# Altium schematic sheet Acondicionamiento_70Q.SchDoc
size A4
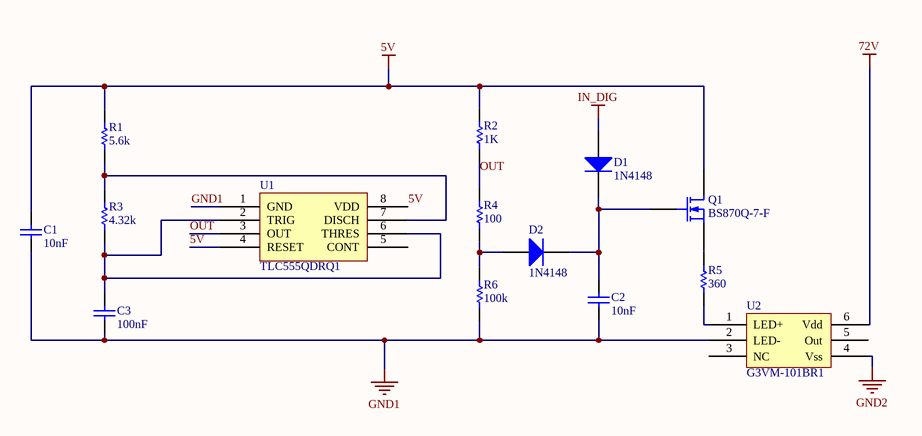
[diagram p0: Acondicionamiento_70Q.SchDoc]

## Parts
C1  10nF  [C0805]
C2  10nF  [C0805]
C3  100nF  [C0805_B]
D1  1N4148  [SOD-323-2]
D2  1N4148  [SOD-323-2]
Q1  BS870Q-7-F  [SOT23_3]
R1  5.6k  [R-0805]
R2  1K  [R-0805]
R3  4.32k  [R-0805]
R4  100  [R-0805]
R5  360  [R-0805]
R6  100k  [R-0805]
U1  TLC555QDRQ1  [SOIC8]
U2  G3VM-101BR1  [DIP-6]

## Nets
5V: C1.2 Q1.3(D) R1.2 R2.2 U1.4(RESET) U1.8(VDD)
72V: U2.6(Vdd)
GND1: C1.1 C2.1 C3.1 R6.1 U1.1(GND) U2.2(LED-)
GND2: U2.4(Vss)
IN_DIG: D1.1(A)
OUT: R2.1 R4.2 U1.3(OUT)
NetC2_2: C2.2 D1.2(K) D2.2(K) Q1.1(G)
NetC3_2: C3.2 R3.1 U1.2(TRIG) U1.6(THRES)
NetD2_1: D2.1(A) R4.1 R6.2
NetQ1_2: Q1.2(S) R5.2
NetR1_1: R1.1 R3.2 U1.7(DISCH)
NetR5_1: R5.1 U2.1(LED+)

Not connected (* = marked no-connect by the designer): U1 5(CONT); U2 3(NC) 5(Out)

## Library data of the parts
C1 C2 = CAP-10nF/50V: C0805C103K5RACTU - CAP, 0.01µF, 50V, 10%, X7R, 0805, REEL; Manufacturer: KEMET; Precio: $0.20; Supplier 1: Newark; Manufacturer Part Number: C0805C103K5RACTU; Stock 1: 2341; Pricing 1: 1=0.018, 25=0.018, 50=0.018, 100=0.018, 250=0.018, 500=0.018, 1000=0.018 (USD); Mount: Surface Mount; Case/Package: 0805; Case Code (Imperial): 0805; Case Code (Metric): 2012; Contact Plating: Tin,Matte; Min Operating Temperature: -55°C; Max Operating Temperature: 125°C; Capacitance: 10nF; Tolerance: 10%; Packaging: Tape and Reel; Voltage Rating (DC): 50V; Dielectric: X7R; Package Quantity: 4000; Voltage Rating: 50V; Termination: SMD/SMT; Voltage: 50V; Length: 2mm; Height: 0.78mm; Width: 1.2mm; Lead Pitch: 0.75mm; Depth: 1.25mm; Radiation Hardening: No; Supplier Part Number 1: 01J3314; ComponentLink1Description: https://www.mouser.mx/datasheet/2/212/KEM_C1002_X7R_SMD-1102033.pdf; ComponentLink1URL: https://www.mouser.mx/datasheet/2/212/KEM_C1002_X7R_SMD-1102033.pdf
C3 = CAP-0.1uF_0805_B: CC0805JPX7R8BB104; Manufacturer: Yageo; Manufacturer Part Number: CC1206JKX7R9BB105; Capacitance: 1uF; Tolerance: 5%; Voltage Rating: 50V; Published: 8-Jun-2000; LatestRevisionDate: 17-Jul-2002; LatestRevisionNote: Re-released for DXP Platform.; PackageReference: RAD-0.3; Publisher: Altium Limited; PackageDescription: Radial Cap, Thru-Hole; 2 Leads; 0.3 in Pin Spacing; Supplier 1: Mouser; Stock 1: 11880; Pricing 1: 1=0.48, 10=0.342, 50=0.342, 100=0.197, 500=0.166, 1000=0.124, 2000=0.117, 4000=0.11, 10000=0.102, 24000=0.092 (USD); Mount: Surface Mount; Case/Package: 1206; Case Code (Imperial): 1206; Case Code (Metric): 3216; Min Operating Temperature: -55°C; Max Operating Temperature: 125°C; Packaging: Cut Tape; ComponentLink1URL: http://www.yageo.com/documents/recent/UPY-GPHC_X7R_6.3V-to-50V_18.pdf?src-supplier=Digi-Key; ComponentLink1Description: http://www.yageo.com/documents/recent/UPY-GPHC_X7R_6.3V-to-50V_18.pdf?src-supplier=Digi-Key; Supplier Part Number 1: 603-CC1206JK7R9BB105; Supplier 2: Mouser; Stock 2: 51578; Pricing 2: 1=0.18, 10=0.091, 50=0.091, 100=0.041, 1000=0.034, 10000=0.024 (USD); Supplier Part Number 2: 603-CC0805JPX7R8BB10
D1 D2 = DIO-1N4148: 1N4148WS-HG3-08; Manufacturer: Vishay Semiconductors; Precio: $0.481; Supplier 1: Mouser; Manufacturer Part Number: 1N4148WS-HG3-08; Stock 1: 9340; Pricing 1: 1=0.37, 10=0.272, 50=0.272, 100=0.138, 500=0.105, 1000=0.064, 3000=0.055, 6000=0.054, 9000=0.045, 10000=0.045, 24000=0.037 (USD); ComponentLink1URL: http://www.vishay.com/docs/85413/1n4148wsg.pdf?src-supplier=Digi-Key; ComponentLink1Description: http://www.vishay.com/docs/85413/1n4148wsg.pdf?src-supplier=Digi-Key
Q1 = MOS_N-BS870Q-7-F: MOSFET CHANNEL N 41V 60V SOT23; Manufacturer: Diodes; Continuous Drain Current (ID): 250mA; Rds On Max: 5R; Input Capacitance: 50pF; Max Power Dissipation: 300mW; Precio: $0.38; Supplier 1: Mouser; Manufacturer Part Number: BS870Q-7-F; Stock 1: 2749; Pricing 1: 1=0.29, 10=0.197, 50=0.197, 100=0.083, 1000=0.056, 10000=0.038 (USD); Mount: Surface Mount; Case/Package: SOT-23; Min Operating Temperature: -55°C; Max Operating Temperature: 150°C; Packaging: Cut Tape; Drain to Source Voltage (Vdss): 60V; ComponentLink1URL: https://www.diodes.com/assets/Datasheets/BS870Q.pdf?src-supplier=Digi-Key; ComponentLink1Description: https://www.diodes.com/assets/Datasheets/BS870Q.pdf?src-supplier=Digi-Key; Supplier Part Number 1: 621-BS870Q-7-F
R1 = RES-5.6K/0805: PCF0805-13-5K6BT1 WELWYN  THIN FILM RESISTOR, 5.6KOHM, 100mW 0.1%; Manufacturer: TT Welwyn; Manufacturer Part Number: PCF0805-13-5K6-B-T1; Resistance: 5.6kR; Voltage Rating: 100V; Temperature Coefficient: 5ppm/°C; Precio: $0.99; Supplier 1: Mouser; Stock 1: 0; Case/Package: 0805; Number of Pins: 2; Weight: 0.000317oz; Case Code (Imperial): 0805; Case Code (Metric): 2012; Min Operating Temperature: -55°C; Max Operating Temperature: 125°C; Power Rating: 100mW; Tolerance: 0.1%; Packaging: Tape and Reel; Package Quantity: 1000; Composition: Thin Film,Metal Film; Termination: SMD/SMT; Military Standard: Not; Voltage Rating (DC): 100V; Voltage Rating (AC): 100V; Length: 2mm; Height: 0.65mm; Width: 1.25mm; Depth: 1.25mm; REACH SVHC: No SVHC; ComponentLink1URL: http://www.mouser.com/ds/2/414/PCF-437472.pdf?src-supplier=Mouser; ComponentLink1Description: http://www.mouser.com/ds/2/414/PCF-437472.pdf?src-supplier=Mouser; ComponentLink2URL: http://www.farnell.com/datasheets/1315872.pdf?src-supplier=Element14; ComponentLink2Description: http://www.farnell.com/datasheets/1315872.pdf?src-supplier=Element14; ComponentLink3URL: http://www.farnell.com/datasheets/1520194.pdf?src-supplier=Element14; ComponentLink3Description: http://www.farnell.com/datasheets/1520194.pdf?src-supplier=Element14; Supplier Part Number 1: 756-PCF0805135K6BT1
R2 = RES-1K/0805: Thin Film Resistors - SMD 1Kohms .1% 25ppm; Manufacturer: Vishay Sfernice; Manufacturer Part Number: P-0805E1001BBT1; Resistance: 1kR; Power Rating: 250mW; Tolerance: 0.1%; Voltage Rating: 100V; Temperature Coefficient: 25ppm/°C; Precio: $1.64; Supplier 1: Mouser; Stock 1: 1066; Pricing 1: 1=1.26, 10=1.04, 50=1.04, 100=0.796, 500=0.685, 1000=0.54, 2000=0.504, 5000=0.479, 10000=0.461, 25000=0.447 (USD); Case/Package: 0805; Weight: 0.000194oz; Case Code (Imperial): 0805; Case Code (Metric): 2012; Min Operating Temperature: -55°C; Max Operating Temperature: 125°C; Packaging: Tape and Reel; Package Quantity: 1000; Termination: SMD/SMT; Composition: Thin Film; Length: 0.08inch; Height: 0.015inch; Width: 0.05inch; ComponentLink1URL: http://www.mouser.com/ds/2/427/pns-65592.pdf?src-supplier=Mouser; ComponentLink1Description: http://www.mouser.com/ds/2/427/pns-65592.pdf?src-supplier=Mouser
R3 = Res-4.32k: ERA-6AEB4321V; Manufacturer: Panasonic; Resistance: 4.32kR; Tolerance: 0.1%; Temperature Coefficient: 25ppm/°C; Voltage Rating: 100V; Power Rating: 125mW; Supplier 1: Mouser; Stock 1: 7358; Pricing 1: 1=0.36, 10=0.302, 50=0.302, 100=0.118, 1000=0.045, 10000=0.034 (USD); Mount: Surface Mount; Case/Package: 0805; Number of Pins: 2; Contact Plating: Tin; Min Operating Temperature: -55°C; Max Operating Temperature: 155°C; Composition: Metal Film,Thin Film; Packaging: Tape and Reel; Package Quantity: 5000; Number of Terminations: 2; Termination: SMD/SMT; Military Standard: Not; Max Power Dissipation: 125mW; Voltage Rating (DC): 100V; Features: Automotive AEC-Q200; Length: 2mm; Height: 0.5mm; Width: 1.25mm; Depth: 1.25mm; Radiation Hardening: No; Lead Free: Lead Free; ComponentLink1URL: http://www.farnell.com/datasheets/485442.pdf?src-supplier=Farnell; ComponentLink1Description: http://www.farnell.com/datasheets/485442.pdf?src-supplier=Farnell; ComponentLink2URL: http://www.mouser.com/ds/2/315/AOA0000CE26-32660.pdf?src-supplier=Mouser; ComponentLink2Description: http://www.mouser.com/ds/2/315/AOA0000CE26-32660.pdf?src-supplier=Mouser; ComponentLink3URL: http://www.farnell.com/datasheets/485442.pdf?src-supplier=Element14; ComponentLink3Description: http://www.farnell.com/datasheets/485442.pdf?src-supplier=Element14; ComponentLink4URL: http://industrial.panasonic.com/www-data/pdf/AOA0000/AOA0000CE26.pdf?src-supplier=Avnet+Europe; ComponentLink4Description: http://industrial.panasonic.com/www-data/pdf/AOA0000/AOA0000CE26.pdf?src-supplier=Avnet+Europe; ComponentLink5URL: http://uk.rs-online.com/webdocs/0eb1/0900766b80eb1d8c.pdf?src-supplier=RSComponents; ComponentLink5Description: http://uk.rs-online.com/webdocs/0eb1/0900766b80eb1d8c.pdf?src-supplier=RSComponents; ComponentLink6URL: https://produktinfo.conrad.com/datenblaetter/450000-474999/459076-da-01-en-WIDERSTAND_0805_ERA.pdf?src-supplier=Conrad; ComponentLink6Description: https://produktinfo.conrad.com/datenblaetter/450000-474999/459076-da-01-en-WIDERSTAND_0805_ERA.pdf?src-supplier=Conrad; Manufacturer Part Number: ERA-6AEB4321V; Case Code (Imperial): 0805; Case Code (Metric): 2012; Supplier Part Number 1: 667-ERA-6AEB4321V
R4 = RES-100: MCU08050C1000FP500; Manufacturer: Vishay Beyschlag; Resistance: 100R; Tolerance: 1%; Temperature Coefficient: 50ppm/°C; Power Rating: 125mW; Voltage Rating: 150V; Max Power Dissipation: 200mW; Precio: $0.65; Supplier 1: Mouser; Manufacturer Part Number: MCU08050C1000FP500; Stock 1: 19308; Pricing 1: 1=0.5, 10=0.285, 50=0.285, 100=0.153, 500=0.123, 1000=0.091, 2500=0.079, 5000=0.072, 10000=0.064, 25000=0.06 (USD); Case/Package: 0805; Weight: 0.000162oz; Contact Plating: Tin; Case Code (Metric): 2012; Case Code (Imperial): 0805; Min Operating Temperature: -55°C; Max Operating Temperature: 125°C; Composition: Thin Film; Package Quantity: 1; Packaging: Tape and Reel; Number of Terminations: 2; Termination: SMD/SMT; Military Standard: Not; Voltage Rating (DC): 150V; Length: 2mm; Height: 0.024inch; Width: 0.049inch; Depth: 1.25mm; Radiation Hardening: No; REACH SVHC: No SVHC; Lead Free: Lead Free; ComponentLink1URL: http://www.vishay.com/docs/28705/mcx0x0xpro.pdf?src-supplier=Digi-Key; ComponentLink1Description: http://www.vishay.com/docs/28705/mcx0x0xpro.pdf?src-supplier=Digi-Key; ComponentLink2URL: http://www.vishay.com/docs/28705/mc_pro.pdf?src-supplier=Avnet; ComponentLink2Description: http://www.vishay.com/docs/28705/mc_pro.pdf?src-supplier=Avnet; ComponentLink3URL: http://www.vishay.com/docs/28705/mc_pro.pdf?src-supplier=Avnet+Europe; ComponentLink3Description: http://www.vishay.com/docs/28705/mc_pro.pdf?src-supplier=Avnet+Europe
R5 = RES-360: ERJ-6ENF3600V            RESISTOR, THICK FILM, 360OHM, 125mW, ± 1%; Manufacturer: Panasonic; Resistance: 360R; Temperature Coefficient: 100ppm/°C; Voltage Rating: 150V; Precio: $0.012; Supplier 1: Newark; Supplier Part Number 1: 52W0059; Manufacturer Part Number: ERJ-6ENF3600V; Stock 1: 0; Mount: Surface Mount; Case/Package: 0805; Contact Plating: Tin; Case Code (Metric): 2012; Case Code (Imperial): 0805; Min Operating Temperature: -55°C; Max Operating Temperature: 155°C; Tolerance: 1%; Composition: Thick Film; Power Rating: 125mW; Packaging: Tape and Reel; Package Quantity: 1; Number of Terminations: 2; Termination: SMD/SMT; Military Standard: Not; Max Power Dissipation: 125mW; Voltage Rating (DC): 150V; Features: Automotive AEC-Q200; Length: 2mm; Height: 0.6mm; Width: 0.049inch; Depth: 1.25mm; Radiation Hardening: No; REACH SVHC: No SVHC; Lead Free: Lead Free; ComponentLink1URL: http://industrial.panasonic.com/www-data/pdf/AOA0000/AOA0000CE2.pdf?src-supplier=Avnet+Europe; ComponentLink1Description: http://industrial.panasonic.com/www-data/pdf/AOA0000/AOA0000CE2.pdf?src-supplier=Avnet+Europe; ComponentLink2URL: https://www.alliedelec.com/m/d/623f45ff1957d936ff56d46fd1c28cac.pdf?src-supplier=Allied+Electronics; ComponentLink2Description: https://www.alliedelec.com/m/d/623f45ff1957d936ff56d46fd1c28cac.pdf?src-supplier=Allied+Electronics; ComponentLink3URL: http://www.mouser.com/ds/2/315/AOA0000CE2-37512.pdf?src-supplier=Mouser; ComponentLink3Description: http://www.mouser.com/ds/2/315/AOA0000CE2-37512.pdf?src-supplier=Mouser; ComponentLink4URL: http://industrial.panasonic.com/www-data/pdf/AOA0000/AOA0000CE2.pdf?src-supplier=Avnet; ComponentLink4Description: http://industrial.panasonic.com/www-data/pdf/AOA0000/AOA0000CE2.pdf?src-supplier=Avnet; ComponentLink5URL: http://www.farnell.com/datasheets/1678782.pdf?src-supplier=Element14; ComponentLink5Description: http://www.farnell.com/datasheets/1678782.pdf?src-supplier=Element14
R6 = RES-100k/0805: TNPW0805100KBEEA Res Thick Film 1206 100K Ohm 1% 0.25W(1/4W) ±100ppm/C Pad SMD T/R; Manufacturer: Vishay Dale; Resistance: 100kR; Power Rating: 125mW; Tolerance: 0.1%; Voltage Rating: 100V; Temperature Coefficient: 25ppm/°C; Precio: $0.306; ComponentLink1URL: http://www.bourns.com/pdfs/chpreztr.pdf?src-supplier=Avnet+Europe; ComponentLink1Description: http://www.bourns.com/pdfs/chpreztr.pdf?src-supplier=Avnet+Europe; ComponentLink2URL: http://www.farnell.com/datasheets/1902866.pdf?src-supplier=Element14; ComponentLink2Description: http://www.farnell.com/datasheets/1902866.pdf?src-supplier=Element14; ComponentLink3URL: http://www.farnell.com/datasheets/691949.pdf?src-supplier=Element14; ComponentLink3Description: http://www.farnell.com/datasheets/691949.pdf?src-supplier=Element14; ComponentLink4URL: http://www.produktinfo.conrad.com/datenblaetter/1000000-1099999/001055523-da-01-en-SMD_WID_CR1206_FX_1003ELF_100K_OHM_1_4W.pdf?src-supplier=Conrad; ComponentLink4Description: http://www.produktinfo.conrad.com/datenblaetter/1000000-1099999/001055523-da-01-en-SMD_WID_CR1206_FX_1003ELF_100K_OHM_1_4W.pdf?src-supplier=Conrad; Supplier 1: Newark; Manufacturer Part Number: TNPW0805100KBEEA; Stock 1: 3964; Pricing 1: 10=0.969, 25=0.688, 50=0.614, 100=0.539, 250=0.482, 500=0.391, 1000=0.318 (USD); Case/Package: 0805; Weight: 0.000194oz; Case Code (Imperial): 0805; Case Code (Metric): 2012; Contact Plating: Tin; Min Operating Temperature: -55°C; Max Operating Temperature: 125°C; Packaging: Tape and Reel; Package Quantity: 1; Termination: SMD/SMT; Composition: Thin Film; Number of Terminations: 2; Military Standard: Not; Max Power Dissipation: 125mW; Voltage Rating (DC): 100V; Features: Moisture Resistant,Automotive AEC-Q200,Anti-Sulfur; Length: 2mm; Height: 0.45mm; Width: 1.2mm; Depth: 1.25mm; Radiation Hardening: No; REACH SVHC: Unknown; Lead Free: Lead Free; ComponentLink5URL: http://www.farnell.com/datasheets/2049119.pdf?src-supplier=Element14; ComponentLink5Description: http://www.farnell.com/datasheets/2049119.pdf?src-supplier=Element14; ComponentLink6URL: http://www.farnell.com/datasheets/1344517.pdf?src-supplier=Element14; ComponentLink6Description: http://www.farnell.com/datasheets/1344517.pdf?src-supplier=Element14; ComponentLink7URL: http://www.vishay.com/docs/49252/_dbr_smd_resistor_product_overview_vmn_sg2189_1705.pdf?src-supplier=Digi-Key; ComponentLink7Description: http://www.vishay.com/docs/49252/_dbr_smd_resistor_product_overview_vmn_sg2189_1705.pdf?src-supplier=Digi-Key; ComponentLink8URL: http://www.vishay.com/docs/28758/tnpw_e3.pdf?src-supplier=Digi-Key; ComponentLink8Description: http://www.vishay.com/docs/28758/tnpw_e3.pdf?src-supplier=Digi-Key; ComponentLink9URL: http://www.vishay.com/docs/28758/tnpw_e3.pdf?src-supplier=Future+Electronics; ComponentLink9Description: http://www.vishay.com/docs/28758/tnpw_e3.pdf?src-supplier=Future+Electronics; ComponentLink10URL: http://www.vishay.com/docs/28758/tnpw_e3.pdf?src-supplier=Avnet; ComponentLink10Description: http://www.vishay.com/docs/28758/tnpw_e3.pdf?src-supplier=Avnet; ComponentLink11URL: https://www.alliedelec.com/m/d/50d2ac1c48d1d3072c857498c4cadcee.pdf?src-supplier=Allied+Electronics; ComponentLink11Description: https://www.alliedelec.com/m/d/50d2ac1c48d1d3072c857498c4cadcee.pdf?src-supplier=Allied+Electronics
U1 = Timer-TLC555-Q1: Standard Timer Single Automotive 8-Pin SOIC T/R; Manufacturer: Texas Instruments; Max Power Dissipation: 725mW; Min Supply Voltage: 2V; Max Supply Voltage: 15V; Frequency: 2.1MHz; Number of Timers/Counters: 1; Operating Supply Current: 360uA; High Level Output Current: -10mA; Low Level Output Current: 100mA; Quiescent Current: 170uA; Supplier 1: Mouser; Manufacturer Part Number: TLC555QDRQ1; Stock 1: 30836; Pricing 1: 1=0.83, 10=0.706, 50=0.706, 100=0.542, 500=0.479, 1000=0.378, 2500=0.336, 10000=0.323, 22500=0.313, 50000=0.303 (USD); Mount: Surface Mount; Case/Package: SOIC; Number of Pins: 8; Weight: 0.002561oz; Contact Plating: Gold; Min Operating Temperature: -40°C; Max Operating Temperature: 125°C; Packaging: Tape and Reel; Package Quantity: 2500; Power Dissipation: 725mW; Nominal Supply Current: 170uA; Radiation Hardening: No; REACH SVHC: No SVHC; Lead Free: Lead Free; ComponentLink1URL: http://focus.ti.com/lit/ds/symlink/tlc555-q1.pdf?src-supplier=Avnet; ComponentLink1Description: http://focus.ti.com/lit/ds/symlink/tlc555-q1.pdf?src-supplier=Avnet; ComponentLink2URL: http://www.farnell.com/datasheets/1806066.pdf?src-supplier=Element14; ComponentLink2Description: http://www.farnell.com/datasheets/1806066.pdf?src-supplier=Element14; ComponentLink3URL: https://www.verical.com/server-webapp/html/getDatasheet?partID=297376&src-supplier=Verical; ComponentLink3Description: https://www.verical.com/server-webapp/html/getDatasheet?partID=297376&src-supplier=Verical; ComponentLink4URL: http://www.ti.com/lit/ds/symlink/tlc555-q1.pdf?src-supplier=Digi-Key; ComponentLink4Description: http://www.ti.com/lit/ds/symlink/tlc555-q1.pdf?src-supplier=Digi-Key; Supplier Part Number 1: 595-TLC555QDRQ1
U2 = Optoacoplador-G3VM-101BR1: G3VM-101BR1 Mosfet Relay SPST 4A 6DIP; Manufacturer: Omron; Supplier 1: Mouser; Manufacturer Part Number: G3VM-101BR1; Stock 1: 175; Pricing 1: 1=11.92, 10=11.18, 25=9.94, 50=9.44, 100=8.95, 250=7.95, 500=7.45, 1000=6.96, 2500=6.71, 10000=6.96 (USD); Supplier Part Number 1: 653-G3VM-101BR1